# Altium project GameBoard_V1I1.PrjPcb (part 8 of 20)

## Sheet [19] - USB.SchDoc
size A2; DocumentNumber: 19; SheetNumber: 19; SheetTotal: 32
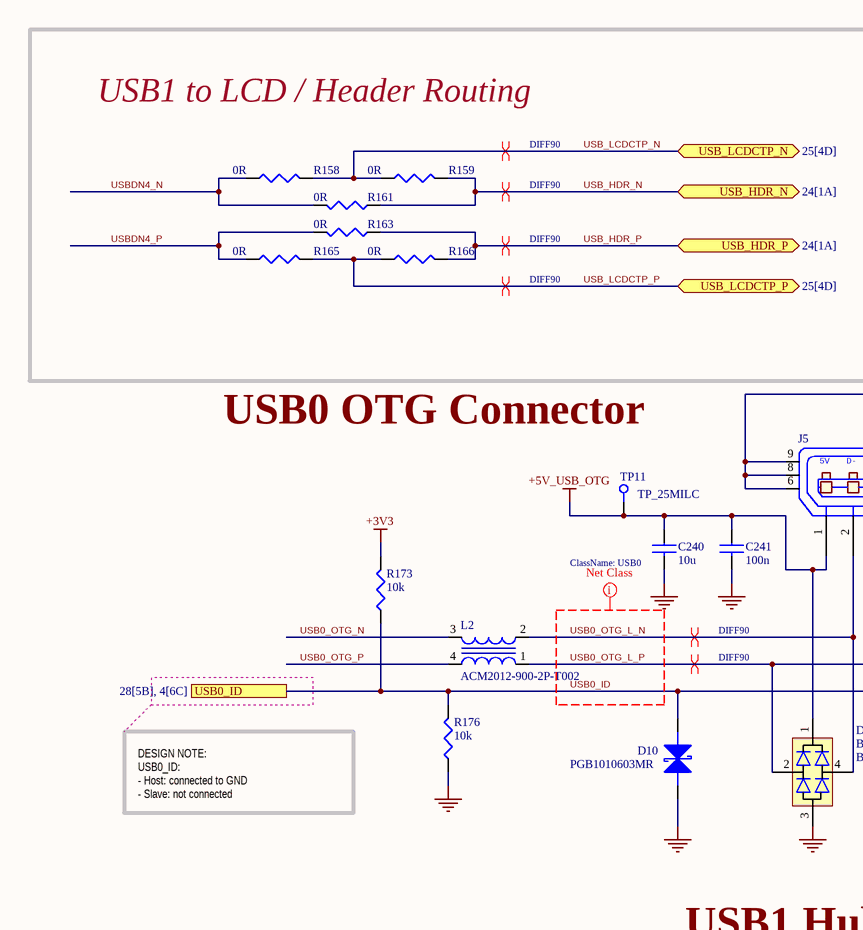
[diagram p48: [19] - USB.SchDoc, top left]
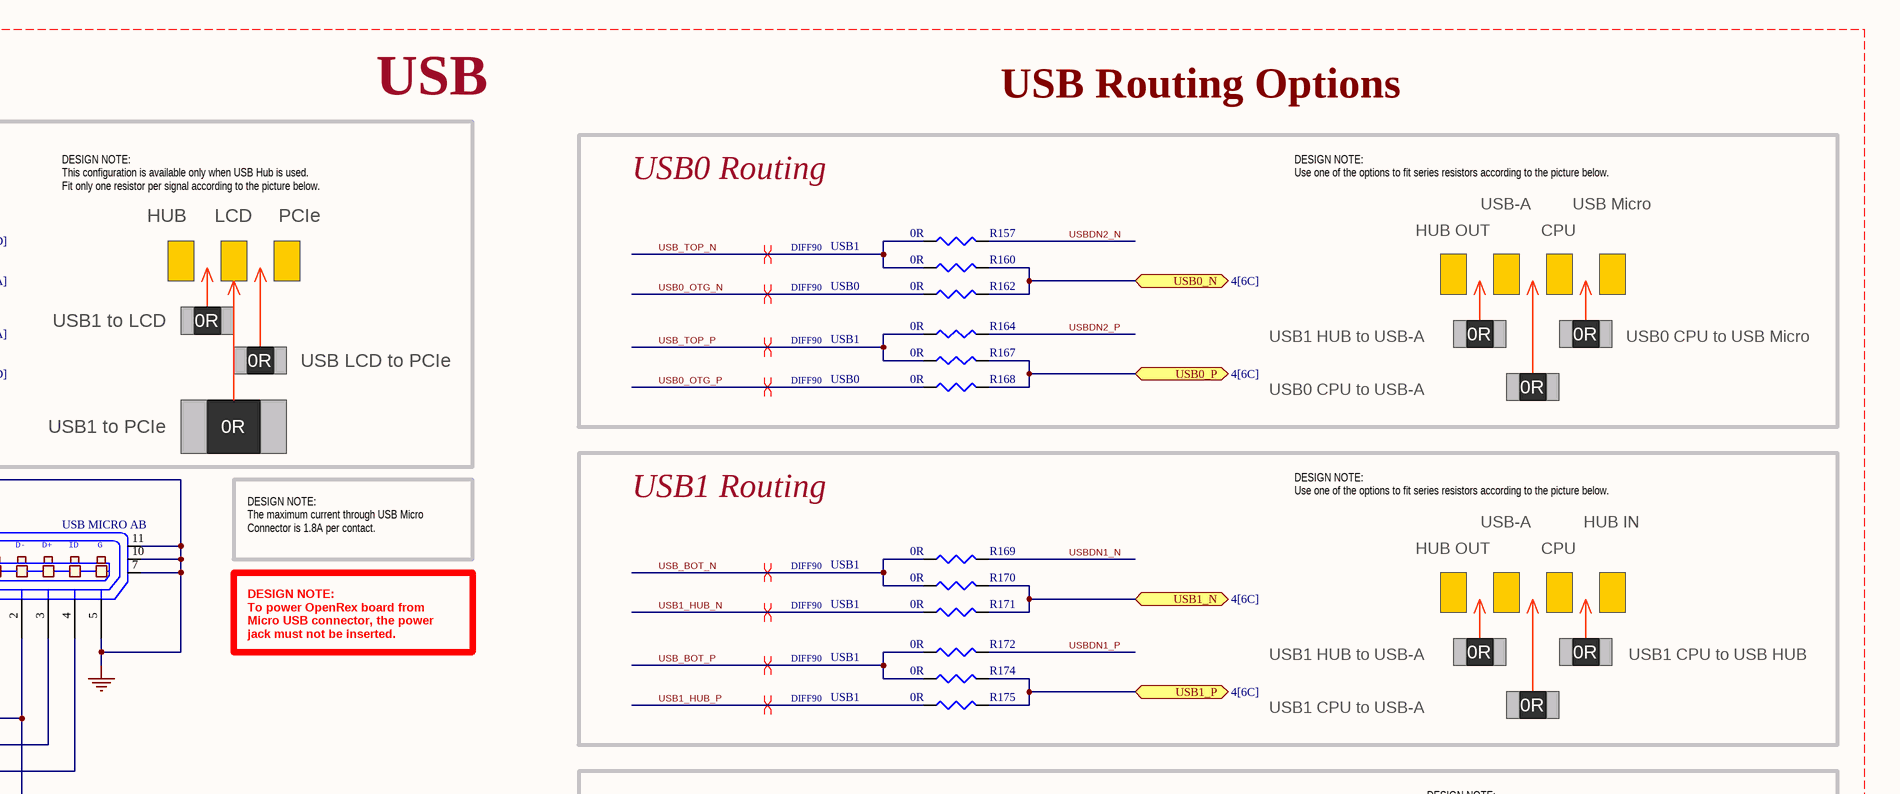
[diagram p49: [19] - USB.SchDoc, top right]
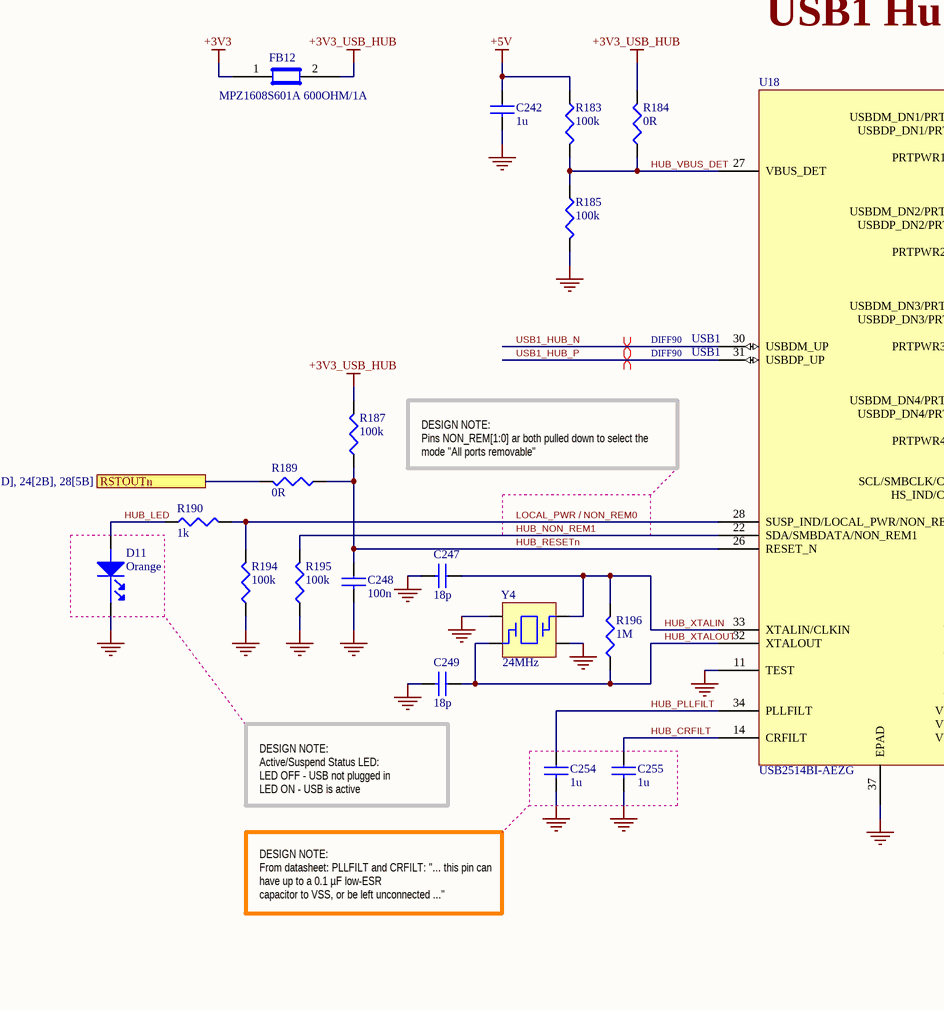
[diagram p50: [19] - USB.SchDoc, bottom left]
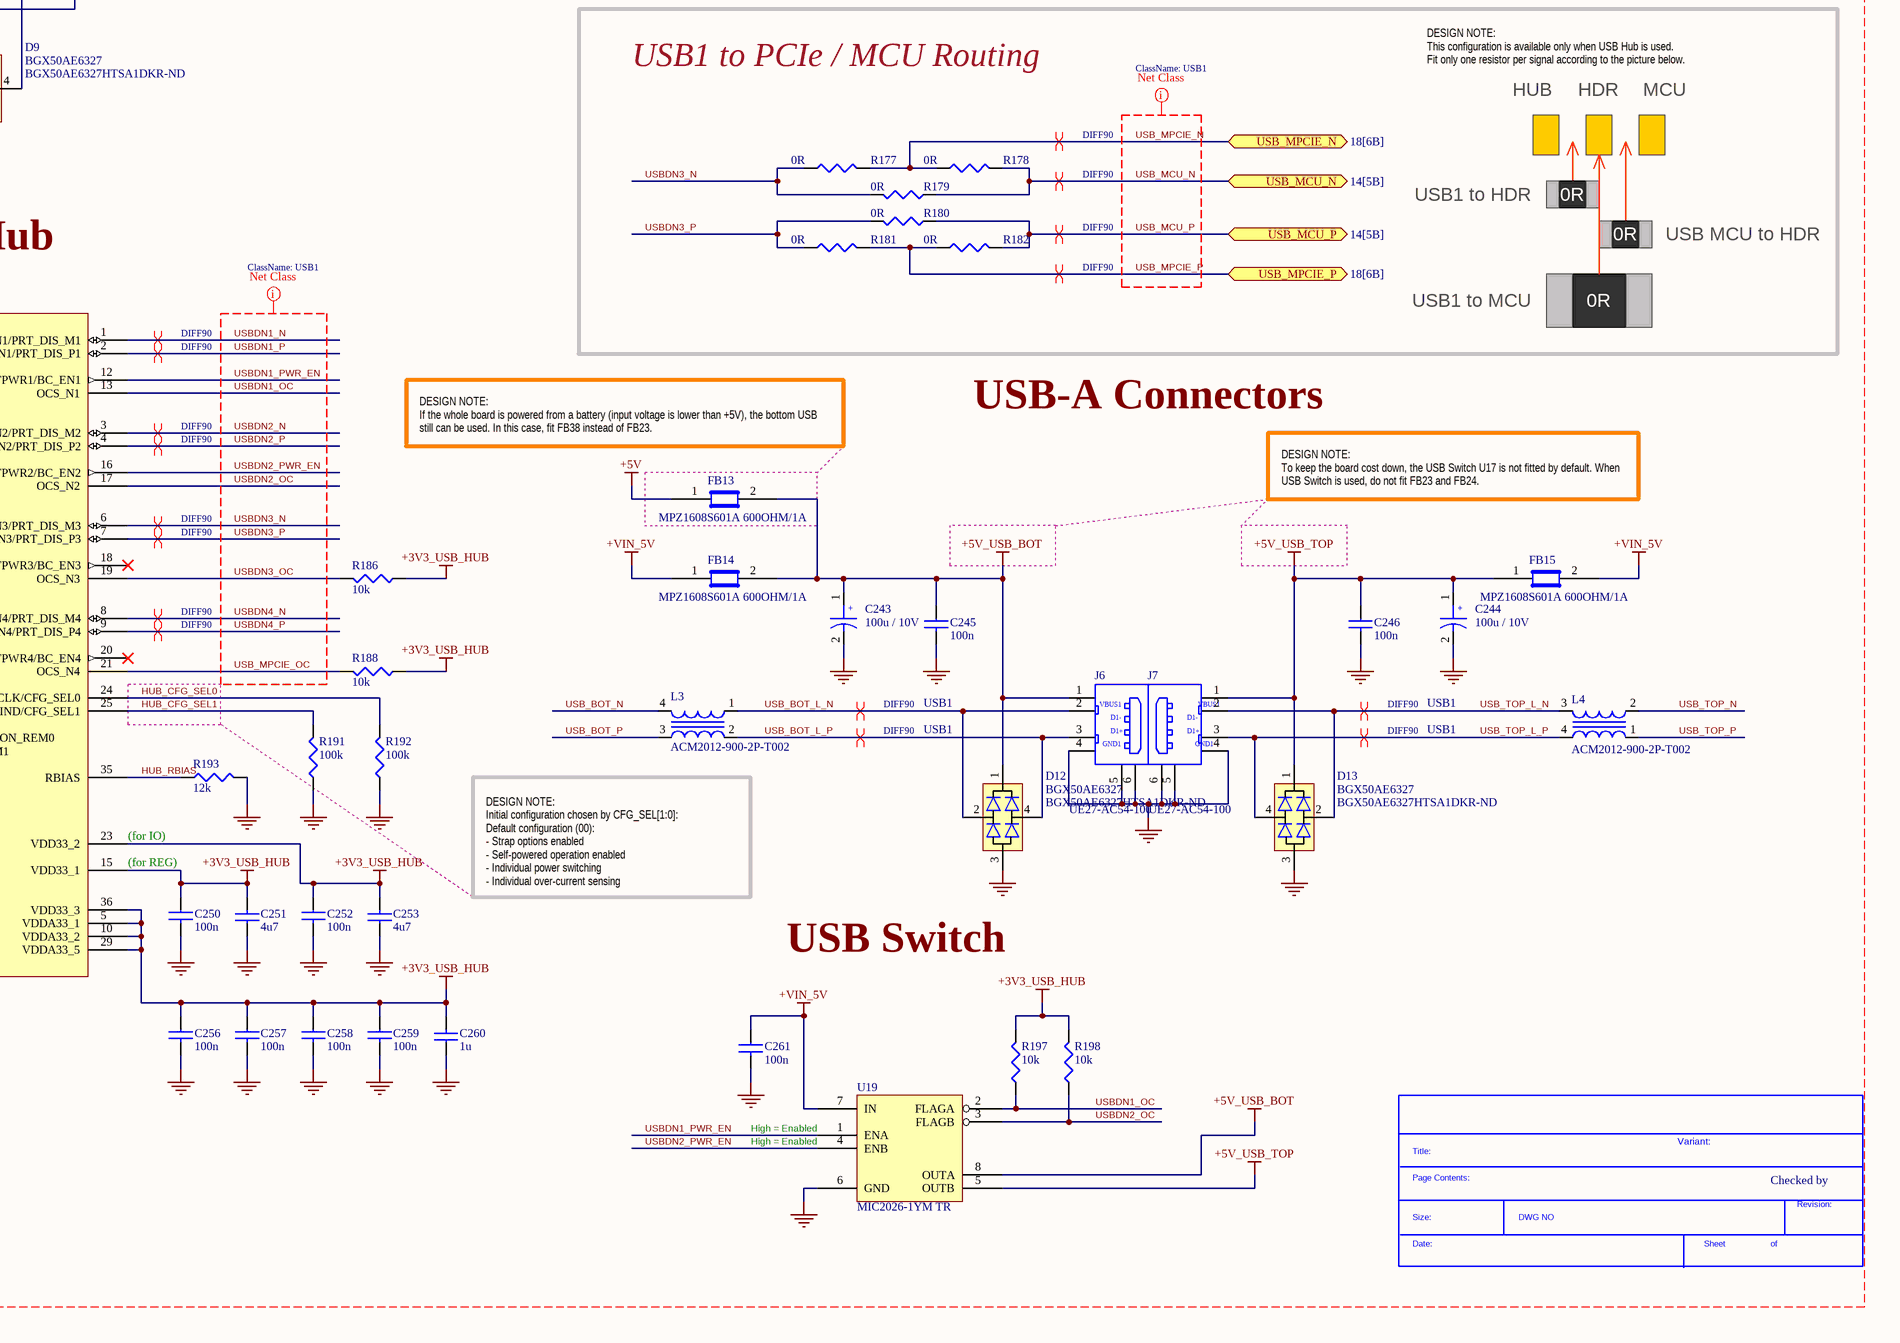
[diagram p51: [19] - USB.SchDoc, bottom right]

### Parts
(Parts that share a designator on the sheet are numbered #1, #2 ... from top to bottom, then left to right.)
*#16  SDTitleBlock  (value not drawn)  (graphical)
C240  10u  [C0603]
C241  100n  [C0402]
C242  1u  [C0402]
C243  100u / 10V  [C2312]
C244  100u / 10V  [C2312]
C245  100n  [C0402]
C246  100n  [C0402]
C247  18p  [C0402]
C248  100n  [C0402]
C249  18p  [C0402]
C250  100n  [C0402]
C251  4u7  [C0402]
C252  100n  [C0402]
C253  4u7  [C0402]
C254  1u  [C0402]
C255  1u  [C0402]
C256  100n  [C0402]
C257  100n  [C0402]
C258  100n  [C0402]
C259  100n  [C0402]
C260  1u  [C0402]
C261  100n  [C0402]
D9  BGX50AE6327  Supplier Part Number 1: BGX50AE6327HTSA1DKR-ND  [SOT143]
D10  PGB1010603MR  [C0603]
D11  Orange  [LED_0603]
D12  BGX50AE6327  Supplier Part Number 1: BGX50AE6327HTSA1DKR-ND  [SOT143]
D13  BGX50AE6327  Supplier Part Number 1: BGX50AE6327HTSA1DKR-ND  [SOT143]
FB12  MPZ1608S601A 600OHM/1A  [C0603]
FB13  MPZ1608S601A 600OHM/1A  [C0603]
FB14  MPZ1608S601A 600OHM/1A  [C0603]
FB15  MPZ1608S601A 600OHM/1A  [C0603]
J5  USB MICRO AB  [USB_Micro_AB]
J6  UE27-AC54-100  [USB-A]
J7  UE27-AC54-100  [USB-A]
L2  ACM2012-900-2P-T002  [ACM2012]
L3  ACM2012-900-2P-T002  [ACM2012]
L4  ACM2012-900-2P-T002  [ACM2012]
R157  0R  [R0402]
R158  0R  [R0402]
R159  0R  [R0402]
R160  0R  [R0402]
R161  0R  [R0805_small]
R162  0R  [R0402]
R163  0R  [R0805_small]
R164  0R  [R0402]
R165  0R  [R0402]
R166  0R  [R0402]
R167  0R  [R0402]
R168  0R  [R0402]
R169  0R  [R0402]
R170  0R  [R0402]
R171  0R  [R0402]
R172  0R  [R0402]
R173  10k  [R0402]
R174  0R  [R0402]
R175  0R  [R0402]
R176  10k  [R0402]
R177  0R  [R0402]
R178  0R  [R0402]
R179  0R  [R0805_small]
R180  0R  [R0805_small]
R181  0R  [R0402]
R182  0R  [R0402]
R183  100k  [R0402]
R184  0R  [R0402]
R185  100k  [R0402]
R186  10k  [R0402]
R187  100k  [R0402]
R188  10k  [R0402]
R189  0R  [R0402]
R190  1k  [R0402]
R191  100k  [R0402]
R192  100k  [R0402]
R193  12k  [R0402]
R194  100k  [R0402]
R195  100k  [R0402]
R196  1M  [R0402]
R197  10k  [R0402]
R198  10k  [R0402]
TP11  TP_25MILC  [TP_25C]  (no BOM)
U18  USB2514BI-AEZG  [QFN36_6mmx6mm]
U19  MIC2026-1YM TR  [8_SOIC_3.9MM]
Y4  24MHz  [ABM8]

### Blocks framed on the sheet
USB: R158 R159 R161 R163 R165 R166
USB0 Routing: R157 R160 R162 R164 R167 R168
USB1 Routing: R169-R172 R174 R175
USB1 to PCIe / MCU Routing: R177-R182

### Ports
RSTOUTn (see 11[6C], 14[4B], 23[1D], 24[2B], 28[5B]), USB0_ID (see 28[5B], 4[6C]), USB0_N (bidir, see 4[6C]), USB0_P (bidir, see 4[6C]), USB1_N (bidir, see 4[6C]), USB1_P (bidir, see 4[6C]), USB_HDR_N (bidir, see 24[1A]), USB_HDR_P (bidir, see 24[1A]), USB_LCDCTP_N (bidir, see 25[4D]), USB_LCDCTP_P (bidir, see 25[4D]), USB_MCU_N (bidir, see 14[5B]), USB_MCU_P (bidir, see 14[5B]), USB_MPCIE_N (bidir, see 18[6B]), USB_MPCIE_P (bidir, see 18[6B])

### Nets
+3V3: FB12.1 R173.2
+3V3_USB_HUB: C250.1 C251.2 C252.1 C253.2 C256.1 C257.1 C258.1 C259.1 C260.2 FB12.2 R184.2 R186.1 R187.2 R188.1 R197.2 R198.2 U18.5(VDDA33_1) U18.10(VDDA33_2) U18.15(VDD33_1) U18.23(VDD33_2) U18.29(VDDA33_5) U18.36(VDD33_3)
+5V: C242.1 FB13.1 R183.1
+5V_USB_BOT: C243.1 C245.1 D12.1 FB13.2 FB14.2 J6.1(VBUS) U19.8(OUTA)
+5V_USB_OTG: C240.1 C241.1 D9.1 J5.1(P1) TP11.1
+5V_USB_TOP: C244.1 C246.1 D13.1 FB15.1 J7.1(VBUS) U19.5(OUTB)
+VIN_5V: C261.1 FB14.1 FB15.2 U19.7(IN)
GND: C240.2 C241.2 C242.2 C243.2 C244.2 C245.2 C246.2 C247.2 C248.2 C249.2 C250.2 C251.1 C252.2 C253.1 C254.2 C255.2 C256.2 C257.2 C258.2 C259.2 C260.1 C261.2 D9.3 D10.2 D11.1(cathode) D12.3 D13.3 J5.5(P5) J5.6 J5.7 J5.8 J5.9 J5.10 J5.11 J6.4(GND) J6.5(SHIELD) J6.6(SHIELD) J7.4(GND) J7.5(SHIELD) J7.6(SHIELD) R176.1 R185.2 R191.1 R192.1 R193.2 R194.1 R195.1 U18.11(TEST) U18.37(EPAD) U19.6(GND) Y4.2 Y4.4
HUB_CFG_SEL0: R192.2 U18.24(SCL/SMBCLK/CFG_SEL0)
HUB_CFG_SEL1: R191.2 U18.25(HS_IND/CFG_SEL1)
HUB_CRFILT: C255.1 U18.14(CRFILT)
HUB_LED: D11.2(ANODE) R190.1
HUB_NON_REM1: R195.2 U18.22(SDA/SMBDATA/NON_REM1)
HUB_PLLFILT: C254.1 U18.34(PLLFILT)
HUB_RBIAS: R193.1 U18.35(RBIAS)
HUB_RESETn: C248.1 R187.1 R189.1 U18.26(RESET_N)
HUB_VBUS_DET: R183.2 R184.1 R185.1 U18.27(VBUS_DET)
HUB_XTALIN: C247.1 R196.2 U18.33(XTALIN/CLKIN) Y4.3
HUB_XTALOUT: C249.1 R196.1 U18.32(XTALOUT) Y4.1
LOCAL_PWR / NON_REM0: R190.2 R194.2 U18.28(SUSP_IND/LOCAL_PWR/NON_REM0)
RSTOUTn: R189.2 ; port RSTOUTn
USB0_ID: D10.1 J5.4(P4) R173.1 R176.2 ; port USB0_ID
USB0_N: R160.2 R162.2 ; port USB0_N
USB0_OTG_L_N: D9.4 J5.2(P2) L2.2
USB0_OTG_L_P: D9.2 J5.3(P3) L2.1
USB0_OTG_N: L2.3 R162.1
USB0_OTG_P: L2.4 R168.1
USB0_P: R167.2 R168.2 ; port USB0_P
USB1_HUB_N: R171.1 U18.30(USBDM_UP)
USB1_HUB_P: R175.1 U18.31(USBDP_UP)
USB1_N: R170.2 R171.2 ; port USB1_N
USB1_P: R174.2 R175.2 ; port USB1_P
USB_BOT_L_N: D12.2 J6.2(D-) L3.1
USB_BOT_L_P: D12.4 J6.3(D+) L3.2
USB_BOT_N: L3.4 R169.1 R170.1
USB_BOT_P: L3.3 R172.1 R174.1
USB_HDR_N: R159.2 R161.2 ; port USB_HDR_N
USB_HDR_P: R163.1 R166.2 ; port USB_HDR_P
USB_LCDCTP_N: R158.2 R159.1 ; port USB_LCDCTP_N
USB_LCDCTP_P: R165.2 R166.1 ; port USB_LCDCTP_P
USB_MCU_N: R178.2 R179.2 ; port USB_MCU_N
USB_MCU_P: R180.1 R182.2 ; port USB_MCU_P
USB_MPCIE_N: R177.2 R178.1 ; port USB_MPCIE_N
USB_MPCIE_OC: R188.2 U18.21(OCS_N4)
USB_MPCIE_P: R181.2 R182.1 ; port USB_MPCIE_P
USB_TOP_L_N: D13.2 J7.2(D-) L4.3
USB_TOP_L_P: D13.4 J7.3(D+) L4.4
USB_TOP_N: L4.2 R157.1 R160.1
USB_TOP_P: L4.1 R164.1 R167.1
USBDN1_N: R169.2 U18.1(USBDM_DN1/PRT_DIS_M1)
USBDN1_OC: R197.1 U18.13(OCS_N1) U19.2(FLAGA)
USBDN1_P: R172.2 U18.2(USBDP_DN1/PRT_DIS_P1)
USBDN1_PWR_EN: U18.12(PRTPWR1/BC_EN1) U19.1(ENA)
USBDN2_N: R157.2 U18.3(USBDM_DN2/PRT_DIS_M2)
USBDN2_OC: R198.1 U18.17(OCS_N2) U19.3(FLAGB)
USBDN2_P: R164.2 U18.4(USBDP_DN2/PRT_DIS_P2)
USBDN2_PWR_EN: U18.16(PRTPWR2/BC_EN2) U19.4(ENB)
USBDN3_N: R177.1 R179.1 U18.6(USBDM_DN3/PRT_DIS_M3)
USBDN3_OC: R186.2 U18.19(OCS_N3)
USBDN3_P: R180.2 R181.1 U18.7(USBDP_DN3/PRT_DIS_P3)
USBDN4_N: R158.1 R161.1 U18.8(USBDM_DN4/PRT_DIS_M4)
USBDN4_P: R163.2 R165.1 U18.9(USBDP_DN4/PRT_DIS_P4)

Not connected (* = marked no-connect by the designer): U18 18(PRTPWR3/BC_EN3)* 20(PRTPWR4/BC_EN4)*

### Layout directives
differential pair; net class DIFF90: USB0_OTG_L_N, USB0_OTG_L_P, USB_HDR_N, USB_HDR_P, USB_LCDCTP_N, USB_LCDCTP_P, USB_MCU_N, USB_MCU_P, USB_MPCIE_N, USB_MPCIE_P, USBDN1_N, USBDN1_P, USBDN2_N, USBDN2_P, USBDN3_N, USBDN3_P, USBDN4_N, USBDN4_P
net class USB1: USB_MCU_N, USB_MCU_P, USB_MPCIE_N, USB_MPCIE_OC, USB_MPCIE_P, USBDN1_N, USBDN1_OC, USBDN1_P, USBDN1_PWR_EN, USBDN2_N, USBDN2_OC, USBDN2_P, USBDN2_PWR_EN, USBDN3_N, USBDN3_OC, USBDN3_P, USBDN4_N, USBDN4_P
net class USB0: USB0_ID, USB0_OTG_L_N, USB0_OTG_L_P
differential pair; net class DIFF90; net class USB1: USB1_HUB_N, USB1_HUB_P, USB_BOT_L_N, USB_BOT_L_P, USB_BOT_N, USB_BOT_P, USB_TOP_L_N, USB_TOP_L_P, USB_TOP_N, USB_TOP_P
differential pair; net class DIFF90; net class USB0: USB0_OTG_N, USB0_OTG_P
net class [19] - USB: +3V3, +3V3_USB_HUB, +5V, +5V_USB_BOT, +5V_USB_OTG, +5V_USB_TOP, +VIN_5V, GND, HUB_CFG_SEL0, HUB_CFG_SEL1, HUB_CRFILT, HUB_LED, HUB_NON_REM1, HUB_PLLFILT, HUB_RBIAS, HUB_RESETn, HUB_VBUS_DET, HUB_XTALIN, HUB_XTALOUT, LOCAL_PWR / NON_REM0, USB0_ID, USB0_OTG_L_N, USB0_OTG_L_P, USB0_OTG_N, USB0_OTG_P, USB1_HUB_N, USB1_HUB_P, USB_BOT_L_N, USB_BOT_L_P, USB_BOT_N, USB_BOT_P, USB_HDR_N, USB_HDR_P, USB_LCDCTP_N, USB_LCDCTP_P, USB_MCU_N, USB_MCU_P, USB_MPCIE_N, USB_MPCIE_OC, USB_MPCIE_P, USB_TOP_L_N, USB_TOP_L_P, USB_TOP_N, USB_TOP_P, USBDN1_N, USBDN1_OC, USBDN1_P, USBDN1_PWR_EN, USBDN2_N, USBDN2_OC, USBDN2_P, USBDN2_PWR_EN, USBDN3_N, USBDN3_OC, USBDN3_P, USBDN4_N, USBDN4_P

### Notes on the sheet
- USB Routing Options
- USB1 to LCD / Header Routing
- DESIGN NOTE:
  This configuration is available only when USB Hub is used.
  Fit only one resistor per signal according to the picture below.
- HUB
- LCD
- PCIe
- DESIGN NOTE:
  Use one of the options to fit series resistors according to the picture below.
- HUB OUT
- USB-A
- CPU
- USB Micro
- USB1 to LCD
- 0R
- USB LCD to PCIe
- USB1 HUB to USB-A
- USB0 CPU to USB Micro
- USB1 to PCIe
- USB0 CPU to USB-A
- USB0 OTG Connector
- DESIGN NOTE:
  The maximum current through USB Micro Connector is 1.8A per contact.
- HUB IN
- DESIGN NOTE:
  To power OpenRex board from Micro USB connector, the power jack must not be inserted.
- USB1 CPU to USB HUB
- USB1 CPU to USB-A
- DESIGN NOTE:
  USB0_ID:
  - Host: connected to GND
  - Slave: not connected
- HDR
- MCU
- USB1 to HDR
- USB1 Hub
- USB MCU to HDR
- USB1 to MCU
- DESIGN NOTE:
  If the whole board is powered from a battery (input voltage is lower than +5V), the bottom USB still can be used. In this case, fit FB38 instead of FB23.
- USB-A Connectors
- DESIGN NOTE:
  To keep the board cost down, the USB Switch U17 is not fitted by default. When USB Switch is used, do not fit FB23 and FB24.
- DESIGN NOTE:
  Pins NON_REM[1:0] ar both pulled down to select the mode "All ports removable"
- (for IO)
- (for REG)
- DESIGN NOTE:
  Initial configuration chosen by CFG_SEL[1:0]:
  Default configuration (00):
  - Strap options enabled
  - Self-powered operation enabled
  - Individual power switching
  - Individual over-current sensing
- USB Switch
- DESIGN NOTE:
  Active/Suspend Status LED:
  LED OFF - USB not plugged in
  LED ON - USB is active
- DESIGN NOTE:
  From datasheet: PLLFILT and CRFILT: "... this pin can have up to a 0.1 µF low-ESR
  capacitor to VSS, or be left unconnected ..."
- (near U19) High = Enabled
- Variant:
- Checked by
- (in symbol 0475890001) 5V; D-; D+; ID; G
- (in symbol SDTitleBlock) Title:; Page Contents:; Revision:; Size:; DWG NO; Date:; Sheet; of
- (in symbol TPSC107K010R0150) +
- (in symbol UE27-AC54-100) VBUS1; D1-; D1+; GND1

### Library data of the parts
C240 = C1608X5R0J106M: CAP CER 10UF 6.3V X5R 20% 0603; Manufacturer: TDK Corporation; Capacitance: 10µF; Value: 10µF; .Checked PCB: used; Category: Capacitors; Supplier Part Number: 445-4112-1-ND; Manufacturer Part Number: C1608X5R0J106M; Operating Temperature: -55°C ~ 85°C; Package / Case: 0603 (1608 Metric); Price 1k [$]: 0.08580; .Checked SCH: used; Voltage - Rated: 6.3V; Features: Low ESR; Supplier: Digikey; Supplier 1: Digi-Key; Supplier Part Number 1: 445-4112-1-ND; RoHS: RoHS Compliant; Stock 1: 48157; Pricing 1: 1=0.46, 10=0.363, 100=0.1898, 250=0.14024, 500=0.1089, 1000=0.0858 (USD); Tolerance: ±20%; Temperature Coefficient: X5R; Mounting Type: Surface Mount, MLCC; Applications: General Purpose; Ratings: -; Size / Dimension: 0.063" L x 0.031" W (1.60mm x 0.80mm); Height - Seated (Max): -; Thickness (Max): 0.037" (0.95mm); Lead Spacing: -; Packaging: Cut Tape (CT); Lead Style: -; ComponentLink1URL: http://www.tdk.com/pdf/general_B11.pdf; ComponentLink1Description: http://www.tdk.com/pdf/general_B11.pdf
C241 C245 C246 C248 C250 C252 C256-C259 C261 = C1005X5R1H104K: CAP CER .10UF 50V X5R 10% 0402; Manufacturer: TDK Corporation; Capacitance: 0.1µF; Value: 100nF; .Checked PCB: used; Category: Capacitors; Supplier Part Number: 445-5942-1-ND; Manufacturer Part Number: C1005X5R1H104K; Operating Temperature: -55°C ~ 85°C; Package / Case: 0402 (1005 Metric); Price 1k [$]: 0.02340; .Checked SCH: used; Voltage - Rated: 50V; Supplier: Digikey; Supplier 1: Digi-Key; Supplier Part Number 1: 445-5942-1-ND; RoHS: RoHS Compliant; Stock 1: 106926; Pricing 1: 1=0.27, 10=0.18, 100=0.072, 250=0.05176, 500=0.0369, 1000=0.027 (USD); Tolerance: ±10%; Temperature Coefficient: X5R; Mounting Type: Surface Mount, MLCC; Applications: General Purpose; Ratings: -; Size / Dimension: 0.039" L x 0.020" W (1.00mm x 0.50mm); Height - Seated (Max): -; Thickness (Max): 0.022" (0.55mm); Lead Spacing: -; Features: -; Packaging: Cut Tape (CT); Lead Style: -; ComponentLink1URL: http://www.tdk.co.jp/tefe02/e412_c.pdf; ComponentLink1Description: http://www.tdk.co.jp/tefe02/e412_c.pdf; Supplier 2: Digi-Key; Supplier Part Number 2: 311-1697-6-ND
C242 C254 C255 C260 = C1005X5R1C105K: CAP CER 1.0UF 16V X5R 0402; Manufacturer: TDK Corporation; Capacitance: 1.0µF; Value: 1uF; .Checked PCB: used; Tolerance: ±10%; Category: Capacitors; Supplier Part Number: 445-4978-1-ND; Manufacturer Part Number: C1005X5R1C105K; Operating Temperature: -55°C ~ 85°C; Package / Case: 0402 (1005 Metric); Price 1k [$]: 0.02080; .Checked SCH: used; Voltage - Rated: 16V; Supplier: Digikey; Supplier 1: Digi-Key; Supplier Part Number 1: 445-4978-1-ND; RoHS: RoHS Compliant; Stock 1: 341010; Pricing 1: 1=0.24, 10=0.16, 100=0.064, 250=0.046, 500=0.0328, 1000=0.024 (USD); Temperature Coefficient: X5R; Mounting Type: Surface Mount, MLCC; Applications: General Purpose; Ratings: -; Size / Dimension: 0.039" L x 0.020" W (1.00mm x 0.50mm); Height - Seated (Max): -; Thickness (Max): 0.022" (0.55mm); Lead Spacing: -; Features: -; Packaging: Cut Tape (CT); Lead Style: -; ComponentLink1URL: http://www.tdk.co.jp/tefe02/e412_c.pdf; ComponentLink1Description: http://www.tdk.co.jp/tefe02/e412_c.pdf; Supplier 2: Digi-Key; Supplier Part Number 2: 445-13181-1-ND
C243 C244 = TPSC107K010R0150: CAP TANT 100UF 10V 10% 2312; Manufacturer: AVX Corporation; Manufacturer Size Code: C; Capacitance: 100µF; ESR (Equivalent Series Resistance): 150 mOhm; Type: Molded; .Creator: MM; .Checked PCB: used; Supplier 1: Digi-Key; Manufacturer Part Number: TPSC107K010R0150; RoHS: RoHS Compliant; Category: Capacitors; Stock 1: 3211; Pricing 1: 1=1, 10=0.85, 100=0.4969, 250=0.4168 (USD); Packaging: Cut Tape (CT); Tolerance: ±10%; Voltage - Rated: 10V; Operating Temperature: -55°C ~ 125°C; Mounting Type: Surface Mount; Package / Case: 2312 (6032 Metric); Size / Dimension: 0.236" L x 0.126" W (6.00mm x 3.20mm); Height - Seated (Max): 0.110" (2.80mm); Lead Spacing: -; Features: General Purpose; Lifetime @ Temp.: -; ComponentLink1URL: http://www.avx.com/docs/Catalogs/tps.pdf; ComponentLink1Description: http://www.avx.com/docs/Catalogs/tps.pdf; Supplier Part Number 1: 478-7995-1-ND; .Checked SCH: used
C247 C249 = C1005C0G1H180J: CAP CER 18PF 50V C0G 5% 0402; Manufacturer: TDK Corporation; .Checked PCB: used; Temperature Coefficient: C0G, NP0; Capacitance: 18pF; Category: Capacitors; Supplier Part Number: 445-1238-1-ND; Manufacturer Part Number: C1005C0G1H180J; Operating Temperature: -55°C ~ 125°C; Package / Case: 0402 (1005 Metric); Price 1k [$]: 0.00468; Value: 18pF; .Checked SCH: used; Voltage - Rated: 50V; Supplier: Digikey; Supplier 1: Digi-Key; Supplier Part Number 1: 445-1238-1-ND; RoHS: RoHS Compliant; Stock 1: 24321; Pricing 1: 1=0.08, 10=0.05, 100=0.018, 250=0.013, 500=0.0096, 1000=0.0065 (USD); Tolerance: ±5%; Mounting Type: Surface Mount, MLCC; Applications: General Purpose; Ratings: -; Size / Dimension: 0.039" L x 0.020" W (1.00mm x 0.50mm); Height - Seated (Max): -; Thickness (Max): 0.022" (0.55mm); Lead Spacing: -; Features: -; Packaging: Cut Tape (CT); Lead Style: -; ComponentLink1URL: http://www.tdk.co.jp/tefe02/e412_c.pdf; ComponentLink1Description: http://www.tdk.co.jp/tefe02/e412_c.pdf
C251 C253 = C1005X5R1A475M: CAP CER 4.7UF 10V 20% X5R 0402; Manufacturer: TDK Corporation; Capacitance: 4.7µF; .Checked PCB: used; Supplier 1: Digi-Key; Supplier Part Number 1: 445-8023-1-ND; Manufacturer Part Number: C1005X5R1A475M; RoHS: RoHS Compliant; Category: Capacitors; Stock 1: 10140; Pricing 1: 1=0.53, 10=0.415, 100=0.25, 250=0.18752, 500=0.16, 1000=0.125, 5000=0.095 (USD); Voltage - Rated: 10V; Tolerance: ±20%; Temperature Coefficient: X5R; Mounting Type: Surface Mount, MLCC; Operating Temperature: -55°C ~ 85°C; Applications: General Purpose; Ratings: -; Package / Case: 0402 (1005 Metric); Size / Dimension: 0.039" L x 0.020" W (1.00mm x 0.50mm); Height - Seated (Max): -; Thickness (Max): -; Lead Spacing: -; Features: -; Packaging: Cut Tape (CT); Lead Style: -; ComponentLink1URL: http://www.tdk.com/pdf/general_B11.pdf; ComponentLink1Description: http://www.tdk.com/pdf/general_B11.pdf; .Checked SCH: used
D9 D12 D13 = BGX50AE6327: DIODE SWITCHING 50V SOT-143; Manufacturer: Infineon Technologies; .Checked PCB: used; Current - DC Forward (If): 140mA; Diode Type: Single Phase; Speed: Small Signal =< 200mA (Io), Any Speed; Reverse Recovery Time (trr): 6ns; Max Repetitive Reverse Voltage (Vrrm): 70V; Forward Voltage: 1.3V; Peak Reverse Current: 100uA; Max Power Dissipation: 210mW; .Checked SCH: used; Category: Discrete Semiconductor Products; Family: Bridge Rectifiers; Manufacturer Part Number: BGX50AE6327; Package / Case: TO-253-4, TO-253AA; Price 1k [$]: 0.10013; Supplier: Digikey; Supplier Part Number: BGX50AINCT-ND; Value: BGX50AE6327; Supplier 1: Digi-Key; RoHS: RoHS Compliant; Stock 1: 0; Pricing 1: 1=0.39, 10=0.294, 100=0.1829, 500=0.12514, 1000=0.09626 (USD); Voltage - Peak Reverse (Max): 50V; Mounting Type: Surface Mount; Packaging: Cut Tape (CT); Supplier Device Package: PG-SOT143-4; ComponentLink1URL: http://www.infineon.com/dgdl/bgx50aseries.pdf?folderId=db3a30431400ef6801141cc1c4cd04e8&fileId=db3a30431400ef6801141cc423c404e9; ComponentLink1Description: http://www.infineon.com/dgdl/bgx50aseries.pdf?folderId=db3a30431400ef6801141cc1c4cd04e8&fileId=db3a30431400ef6801141cc423c404e9; Mount: Surface Mount; Case/Package: SOT-143-4; Number of Pins: 4; Contact Plating: Matte,Tin; Min Operating Temperature: -65°C; Max Operating Temperature: 150°C; Forward Current: 140mA; Reverse Recovery Time: 6ns; Recovery Time: 6ns; Package Quantity: 3000; Length: 2.9mm; Height: 1mm; Width: 1.3mm
D10 = PGB1010603MR: SUPPRESSOR ESD 24VDC 0603 SMD; Manufacturer: Littelfuse Inc; Voltage - Reverse Standoff (Typ): 24V; Polarization: Bidirectional; .Creator: MM; .Checked PCB: used; Supplier 1: Digi-Key; Manufacturer Part Number: PGB1010603MR; RoHS: RoHS Compliant; Category: Circuit Protection; Stock 1: 155406; Pricing 1: 1=0.66, 10=0.556, 25=0.4872, 100=0.4172, 250=0.3618, 500=0.30646 (USD); Packaging: Cut Tape (CT); Voltage - Breakdown: -; Power (Watts): -; Mounting Type: Surface Mount; Package / Case: 0603 (1608 Metric); Supplier Device Package: 0603 (1608 Metric); ComponentLink1URL: http://www.littelfuse.com/data/en/Data_Sheets/Littelfuse_PulseGuard-ESD_PGB1.pdf; ComponentLink1Description: http://www.littelfuse.com/data/en/Data_Sheets/Littelfuse_PulseGuard-ESD_PGB1.pdf; Supplier Part Number 1: F2594CT-ND; .Checked SCH: used
D11 = LO L29K-H2K1-24-Z: LED SMARTLED ORANGE 606NM 0603; Manufacturer: OSRAM Opto Semiconductors Inc; Millicandela Rating: 6.3mcd; Voltage - Forward (Vf) Typ: 1.8V; Current - Test: 2mA; Wavelength - Peak: 610nm; Viewing Angle: 160°; Lens Type: Diffused; Lens Style/Size: Rectangle with Flat Top, 1.3mm x 0.8mm; Luminous Flux @ Current - Test: 25 mlm; .Checked PCB: used; Supplier 1: Digi-Key; Supplier Part Number 1: 475-2740-1-ND; Manufacturer Part Number: LO L29K-H2K1-24-Z; RoHS: RoHS Compliant; Category: Optoelectronics; Stock 1: 15900; Pricing 1: 1=0.17, 10=0.141, 100=0.1127, 250=0.0986, 500=0.09016 (USD); Color: Orange; Wavelength - Dominant: 606nm; Package / Case: 0603 (1608 Metric); Size / Dimension: 1.70mm L x 0.80mm W; Height: 0.65mm; Mounting Type: Surface Mount; Packaging: Cut Tape (CT); ComponentLink1URL: http://catalog.osram-os.com/catalogue/catalogue.do;jsessionid=302CF83AF637AE24E40AEB0ADA267EDD?act=downloadFile&favOid=020000010003f9de000100b6; ComponentLink1Description: http://catalog.osram-os.com/catalogue/catalogue.do;jsessionid=302CF83AF637AE24E40AEB0ADA267EDD?act=downloadFile&favOid=020000010003f9de000100b6; .Checked SCH: used
FB12-FB15 = MPZ1608S601A: FERRITE CHIP BEAD 600 OHM SMD 1A; Manufacturer: TDK Corporation; Impedance @ Frequency: 600 Ohm @ 100MHz; DC Resistance (DCR): 150 mOhm Max; Filter Type: Differential Mode - Single; Number of Lines: 1; .Checked PCB: used; Supplier 1: Digi-Key; Supplier Part Number 1: 445-2205-1-ND; Manufacturer Part Number: MPZ1608S601A; RoHS: RoHS Compliant; Category: Filters; Stock 1: 328345; Pricing 1: 1=0.36, 10=0.24, 100=0.096, 250=0.069, 500=0.0492, 1000=0.036 (USD); Current Rating: 1A; Package / Case: 0603 (1608 Metric); Mounting Type: Surface Mount; Packaging: Cut Tape (CT); Height (Max): 0.037" (0.95mm); Size / Dimension: 0.063" L x 0.031" W (1.60mm x 0.80mm); ComponentLink1URL: http://www.tdk.co.jp/tefe02/e9413_mpz.pdf; ComponentLink1Description: http://www.tdk.co.jp/tefe02/e9413_mpz.pdf; .Checked SCH: used
J5 = 0475890001: CONN RCPT MICRO USB AB R/A SMD; Manufacturer: Molex Inc; Connector Type: USB - micro AB; Number of Contacts: 5; Gender: Receptacle; .Creator: MM; .Checked PCB: used; Supplier 1: Digi-Key; Manufacturer Part Number: 0475890001; RoHS: RoHS Compliant; Category: Connectors, Interconnects; Stock 1: 12754; Pricing 1: 1=0.81, 10=0.764, 25=0.6872, 50=0.6108, 100=0.5854, 250=0.53452, 500=0.50908 (USD); Packaging: Cut Tape (CT); Specifications: -; Mounting Type: Surface Mount, Right Angle, Horizontal; Features: Board Guide, Shielded; Ingress Protection: -; ComponentLink1URL: http://www.molex.com/pdm_docs/sd/475890001_sd.pdf; ComponentLink1Description: http://www.molex.com/pdm_docs/sd/475890001_sd.pdf; Supplier Part Number 1: WM17143CT-ND; .Checked SCH: used
J6 J7 = UE27-AC54-100: USB - A USB 2.0 Receptacle Connector 4 Position Through Hole, Right Angle, Horizontal; Manufacturer: Amphenol Commercial; Number of Contacts: 4; Number of Ports: 1; Max Voltage Rating (AC): 30V; .Creator: MB; Supplier 1: Digi-Key; Manufacturer Part Number: UE27-AC54-100; Stock 1: 16102; Pricing 1: 1=0.52, 10=0.486, 25=0.4376, 50=0.3888, 100=0.3726, 250=0.3402, 500=0.324, 1000=0.2673, 2500=0.243 (USD); Mount: Through Hole,Horizontal; Case/Package: Module; Contact Plating: Nickel,Tin,Gold; Contact Material: Nickel,Copper Alloy; Colour: Black; Number of Terminals: 4; Housing Material: Thermoplastic; Min Operating Temperature: -55°C; Max Operating Temperature: 85°C; Termination: Solder; Orientation: Right Angle; Package Quantity: 120; Packaging: Tray; Gender: Receptacle; Connector Type: USB; Number of Positions: 4; Length: 14.5mm; Depth: 13.85mm; Radiation Hardening: No; REACH SVHC: Unknown; Lead Free: Lead Free; Flammability Rating: UL94 V-0; ComponentLink1URL: https://datasheet.ciiva.com/3095/usb-cat-3095736.pdf; ComponentLink1Description: https://datasheet.ciiva.com/3095/usb-cat-3095736.pdf; ComponentLink2URL: https://datasheet.ciiva.com/16668/usb-cat-16668272.pdf; ComponentLink2Description: https://datasheet.ciiva.com/16668/usb-cat-16668272.pdf; ComponentLink3URL: https://datasheet.ciiva.com/851/ue27acx4x0x-851297.pdf; ComponentLink3Description: https://datasheet.ciiva.com/851/ue27acx4x0x-851297.pdf; ComponentLink4URL: https://datasheet.ciiva.com/12494/ue27acx4x0x-45641-12494043.pdf; ComponentLink4Description: https://datasheet.ciiva.com/12494/ue27acx4x0x-45641-12494043.pdf; Supplier Part Number 1: UE27AC54100-ND; .Checked SCH: *; .Checked PCB: *
L2-L4 = ACM2012-900-2P-T002: CHOKE COMM MODE 90 OHM .4A SMD; Manufacturer: TDK Corporation; Filter Type: Data, Signal Line; Number of Lines: 2; Current: 400mA; DC Resistance (DCR): 190 mOhm Max; Impedance: 90 Ohm; Resistance (Ohms): 8.2K; Power (Watts): 0.063W, 1/16W; Temperature Coefficient: ±100ppm/°C; Tolerance: ±1%; .Checked PCB: used; Supplier 1: Digi-Key; Supplier Part Number 1: 445-2207-1-ND; Manufacturer Part Number: ACM2012-900-2P-T002; RoHS: RoHS Compliant; Category: Filters; Stock 1: 175768; Pricing 1: 1=0.48, 10=0.448, 50=0.42, 100=0.364, 500=0.308, 1000=0.252 (USD); Inductance: -; Mounting Type: Surface Mount; Size / Dimension: 0.079" L x 0.047" W (2.00mm x 1.20mm); Height (Max): 0.051" (1.30mm); Package / Case: 0805 (2012 Metric), 4 Lead; Operating Temperature: -25°C ~ 85°C; Packaging: Cut Tape (CT); ComponentLink1URL: http://www.tdk.co.jp/tefe02/e9719_acm2012.pdf; ComponentLink1Description: http://www.tdk.co.jp/tefe02/e9719_acm2012.pdf; Composition: Thick Film; Features: -; Height: 0.016" (0.40mm); Number of Terminations: 2; ComponentLink2URL: http://www.yageo.com/documents/recent/PYu-RC0402_51_RoHS_L_6.pdf; ComponentLink2Description: http://www.yageo.com/documents/recent/PYu-RC0402_51_RoHS_L_6.pdf; .Checked SCH: used; Supplier 2: Digi-Key; Supplier Part Number 2: SRF2012-900YACT-ND
R157-R160 R162 R164-R172 R174 R175 R177 R178 R181 R182 R184 R189 = RC0402JR-070RL: RES 0.0 OHM 1/16W 0402 SMD; Manufacturer: Yageo; Resistance (Ohms): 0.0; Power (Watts): 0.063W, 1/16W; Tolerance: Jumper; .Checked PCB: used; Category: Resistors; Supplier Part Number: 311-0.0JRCT-ND; Manufacturer Part Number: RC0402JR-070RL; Package / Case: 0402 (1005 Metric); Price 1k [$]: 0.01389; Value: 0R; .Checked SCH: used; Supplier: Digikey; Supplier 1: Digi-Key; Supplier Part Number 1: 311-0.0JRCT-ND; RoHS: RoHS Compliant; Stock 1: 1106330; Pricing 1: 10=0.012, 50=0.009, 100=0.0069, 250=0.00512, 500=0.0038, 1000=0.00253 (USD); Composition: Thick Film; Features: -; Temperature Coefficient: -; Size / Dimension: 0.039" L x 0.020" W (1.00mm x 0.50mm); Height: 0.016" (0.40mm); Number of Terminations: 2; Packaging: Cut Tape (CT); ComponentLink1URL: http://www.yageo.com/documents/recent/PYu-RC0402_51_RoHS_L_6.pdf; ComponentLink1Description: http://www.yageo.com/documents/recent/PYu-RC0402_51_RoHS_L_6.pdf
R161 R163 R179 R180 = RC0805JR-070RL_small: RES 0.0 OHM 1/8W 0805 SMD; Manufacturer: Yageo; Resistance (Ohms): 0.0; Power (Watts): 0.125W, 1/8W; Tolerance: Jumper; .Checked PCB: used; .Creator: MM; Category: Resistors; Supplier Part Number: 311-0.0ARCT-ND; Manufacturer Part Number: RC0805JR-070RL; Package / Case: 0805 (2012 Metric); Price 1k [$]: 0.01479; Value: 0R; .Checked SCH: used; Supplier: Digikey; Supplier 1: Digi-Key; Supplier Part Number 1: 311-0.0ARCT-ND; RoHS: RoHS Compliant; Stock 1: 933202; Pricing 1: 10=0.017, 50=0.0126, 100=0.0096, 250=0.00716, 500=0.00528, 1000=0.00352 (USD); Composition: Thick Film; Features: -; Temperature Coefficient: -; Size / Dimension: 0.079" L x 0.049" W (2.00mm x 1.25mm); Height: 0.024" (0.60mm); Number of Terminations: 2; Packaging: Cut Tape (CT); ComponentLink1URL: http://www.yageo.com/documents/recent/PYu-RC0805_51_RoHS_L_4.pdf; ComponentLink1Description: http://www.yageo.com/documents/recent/PYu-RC0805_51_RoHS_L_4.pdf
R173 R176 R186 R188 R197 R198 = RC0402FR-0710KL: RES 10.0K OHM 1/16W 1% 0402 SMD; Manufacturer: Yageo; Power (Watts): 0.063W, 1/16W; .Checked PCB: used; Temperature Coefficient: ±100ppm/°C; Category: Resistors; Supplier Part Number: 311-10.0KLRCT-ND; Manufacturer Part Number: RC0402FR-0710KL; Package / Case: 0402 (1005 Metric); Price 1k [$]: 0.01421; Resistance (Ohms): 10K; Tolerance: ±1%; Value: 10k; .Checked SCH: used; Supplier: Digikey; Supplier 1: Digi-Key; Supplier Part Number 1: 311-10.0KLRCT-ND; RoHS: RoHS Compliant; Stock 1: 2916495; Pricing 1: 10=0.014, 50=0.0104, 100=0.0079, 250=0.00584, 500=0.00432, 1000=0.00288 (USD); Composition: Thick Film; Features: -; Size / Dimension: 0.039" L x 0.020" W (1.00mm x 0.50mm); Height: 0.016" (0.40mm); Number of Terminations: 2; Packaging: Cut Tape (CT); ComponentLink1URL: http://www.yageo.com/documents/recent/PYu-RC0402_51_RoHS_L_6.pdf; ComponentLink1Description: http://www.yageo.com/documents/recent/PYu-RC0402_51_RoHS_L_6.pdf
R183 R185 R187 R191 R192 R194 R195 = RMCF0402FT100K: RES 100K OHM 1/16W 1% 0402 SMD; Manufacturer: Stackpole Electronics Inc; Power (Watts): 0.063W, 1/16W; .Checked PCB: used; Temperature Coefficient: ±100ppm/°C; Category: Resistors; Supplier Part Number: RMCF0402FT100KCT-ND; Manufacturer Part Number: RMCF0402FT100K; Package / Case: 0402 (1005 Metric); Price 1k [$]: 0.00384; Resistance (Ohms): 100K; Tolerance: ±1%; Value: 100k; .Checked SCH: used; Supplier: Digikey; Supplier 1: Digi-Key; Supplier Part Number 1: YAG1343DKR-ND; RoHS: RoHS Compliant; Composition: Thick Film; Features: -; Size / Dimension: 0.039" L x 0.020" W (1.00mm x 0.50mm); Height: 0.016" (0.40mm); Number of Terminations: 2; Packaging: Cut Tape (CT); ComponentLink1URL: http://www.seielect.com/Catalog/SEI-RMCF.pdf; ComponentLink1Description: http://www.seielect.com/Catalog/SEI-RMCF.pdf
R190 = RC0402FR-071KL: RES 1.00K OHM 1/16W 1% 0402 SMD; Manufacturer: Yageo; Power (Watts): 0.063W, 1/16W; .Checked PCB: used; Temperature Coefficient: ±100ppm/°C; Category: Resistors; Supplier Part Number: 311-1.00KLRCT-ND; Manufacturer Part Number: RC0402FR-071KL; Package / Case: 0402 (1005 Metric); Price 1k [$]: 0.01421; Resistance (Ohms): 1K; Tolerance: ±1%; Value: 1k; .Checked SCH: used; Supplier: Digikey; Supplier 1: Digi-Key; Supplier Part Number 1: 311-1.00KLRCT-ND; RoHS: RoHS Compliant; Stock 1: 1753477; Pricing 1: 10=0.014, 50=0.0104, 100=0.0079, 250=0.00584, 500=0.00432, 1000=0.00288 (USD); Composition: Thick Film; Features: -; Size / Dimension: 0.039" L x 0.020" W (1.00mm x 0.50mm); Height: 0.016" (0.40mm); Number of Terminations: 2; Packaging: Cut Tape (CT); ComponentLink1URL: http://www.yageo.com/documents/recent/PYu-RC0402_51_RoHS_L_6.pdf; ComponentLink1Description: http://www.yageo.com/documents/recent/PYu-RC0402_51_RoHS_L_6.pdf
R193 = RC0402FR-0712KL: RES 12.0K OHM 1/16W 1% 0402 SMD; Manufacturer: Yageo; Power (Watts): 0.063W, 1/16W; .Checked PCB: used; Temperature Coefficient: ±100ppm/°C; Category: Resistors; Supplier Part Number: 311-12.0KLRCT-ND; Manufacturer Part Number: RC0402FR-0712KL; Package / Case: 0402 (1005 Metric); Price 1k [$]: 0.01421; Resistance (Ohms): 12K; Tolerance: ±1%; Value: 12k; .Checked SCH: used; Supplier: Digikey; Supplier 1: Digi-Key; Supplier Part Number 1: 311-12.0KLRCT-ND; RoHS: RoHS Compliant; Stock 1: 526086; Pricing 1: 10=0.014, 50=0.0104, 100=0.0079, 250=0.00584, 500=0.00432, 1000=0.00288 (USD); Composition: Thick Film; Features: -; Size / Dimension: 0.039" L x 0.020" W (1.00mm x 0.50mm); Height: 0.016" (0.40mm); Number of Terminations: 2; Packaging: Cut Tape (CT); ComponentLink1URL: http://www.yageo.com/documents/recent/PYu-RC0402_51_RoHS_L_6.pdf; ComponentLink1Description: http://www.yageo.com/documents/recent/PYu-RC0402_51_RoHS_L_6.pdf
R196 = RC0402FR-071ML: RES 1.00M OHM 1/16W 1% 0402 SMD; Manufacturer: Yageo; Power (Watts): 0.063W, 1/16W; .Checked PCB: used; Temperature Coefficient: ±100ppm/°C; Category: Resistors; Supplier Part Number: 311-1.00MLRCT-ND; Manufacturer Part Number: RC0402FR-071ML; Package / Case: 0402 (1005 Metric); Price 1k [$]: 0.00288; Resistance (Ohms): 1M; Tolerance: ±1%; Value: 1M; .Checked SCH: used; Supplier: Digikey; Supplier 1: Digi-Key; Supplier Part Number 1: 311-1.00MLRCT-ND; RoHS: RoHS Compliant; Stock 1: 102060; Pricing 1: 10=0.014, 50=0.0104, 100=0.0079, 250=0.00584, 500=0.00432, 1000=0.00288 (USD); Composition: Thick Film; Features: -; Size / Dimension: 0.039" L x 0.020" W (1.00mm x 0.50mm); Height: 0.016" (0.40mm); Number of Terminations: 2; Packaging: Cut Tape (CT); ComponentLink1URL: http://www.yageo.com/documents/recent/PYu-RC0402_51_RoHS_L_6.pdf; ComponentLink1Description: http://www.yageo.com/documents/recent/PYu-RC0402_51_RoHS_L_6.pdf
TP11 = TP_25MILC: Test Point 25mil; .Checked PCB: used
U18 = USB2514BI-AEZG: USB HUB CONT IND TEMP 36QFNE3; Manufacturer: Microchip Technology; Function: Hub Controller; Standards: USB 2.0; Voltage - Supply: 3 V ~ 3.6 V; Current - Supply: 85mA; .Creator: MM; .Checked PCB: used; Supplier 1: Digi-Key; Manufacturer Part Number: USB2514BI-AEZG; RoHS: RoHS Compliant; Category: Integrated Circuits (ICs); Stock 1: 1662; Pricing 1: 1=3.78, 10=3.26, 25=2.72, 100=2.47 (USD); Packaging: Tube; Protocol: USB; Interface: USB; Operating Temperature: -40°C ~ 85°C; Package / Case: 36-TQFN Exposed Pad; Supplier Device Package: 36-QFN-EP (6x6); ComponentLink1URL: http://www.smsc.com/Downloads/SMSC/Downloads_Public/Data_Sheets/251xb.pdf; ComponentLink1Description: http://www.smsc.com/Downloads/SMSC/Downloads_Public/Data_Sheets/251xb.pdf; Supplier Part Number 1: USB2514BI-AEZG-ND; .Checked SCH: used
U19 = MIC2026-1YM TR: IC SW DISTRIBUTION 2CHAN 8SOIC; Manufacturer: Micrel Inc; .Checked PCB: used; Number of Outputs: 2; Rds (On): 140 mOhm; Internal Switch(s): Yes; Current Limit: 900mA; Voltage - Input: 2.7 V ~ 5.5 V; .Checked SCH: used; Category: Integrated Circuits (ICs); Family: PMIC - Power Distribution Switches; Manufacturer Part Number: MIC2026-1YM TR; Operating Temperature: -40°C ~ 85°C; Package / Case: 8-SOIC (0.154", 3.90mm Width); Price 1k [$]: 0.53200; Supplier: Digikey; Supplier Part Number: 576-1059-1-ND; Value: MIC2026-1YM TR; Supplier 1: Digi-Key; Supplier Part Number 1: 576-1059-1-ND; RoHS: RoHS Compliant; Stock 1: 44857; Pricing 1: 1=1.14, 25=0.95, 100=0.76, 250=0.57, 500=0.532 (USD); Type: High Side Switch; Mounting Type: Surface Mount; Supplier Device Package: 8-SOIC; Packaging: Cut Tape (CT); ComponentLink1URL: http://www.micrel.com/_PDF/mic2026.pdf; ComponentLink1Description: http://www.micrel.com/_PDF/mic2026.pdf
Y4 = ABM8-24.000MHZ-R60-D-1-W-T: CRYSTAL 24MHZ 18PF SMD; Manufacturer: Abracon Corporation; Frequency Stability: ±25ppm; Frequency Tolerance: ±10ppm; ESR (Equivalent Series Resistance): 50 Ohm; Operating Mode: Fundamental; .Creator: MM; .Checked PCB: used; Supplier 1: Digi-Key; Manufacturer Part Number: ABM8-24.000MHZ-R60-D-1-W-T; RoHS: RoHS Compliant; Category: Crystals and Oscillators; Stock 1: 11496; Pricing 1: 1=1.42, 10=1.356, 50=1.326, 100=1.134, 500=1.104 (USD); Packaging: Cut Tape (CT); Type: MHz Crystal; Frequency: 24MHz; Load Capacitance: 18pF; Operating Temperature: -40°C ~ 85°C; Ratings: -; Mounting Type: Surface Mount; Package / Case: 4-SMD, No Lead (DFN, LCC); Size / Dimension: 0.126" L x 0.098" W (3.20mm x 2.50mm); Height: 0.031" (0.80mm); ComponentLink1URL: http://www.abracon.com/Resonators/abm8.pdf; ComponentLink1Description: http://www.abracon.com/Resonators/abm8.pdf; Supplier Part Number 1: 535-10155-1-ND; .Checked SCH: used

## Sheet [07] - CPU - CSI, FLASH.SchDoc
size A2; DocumentNumber: 7; SheetNumber: 7; SheetTotal: 32
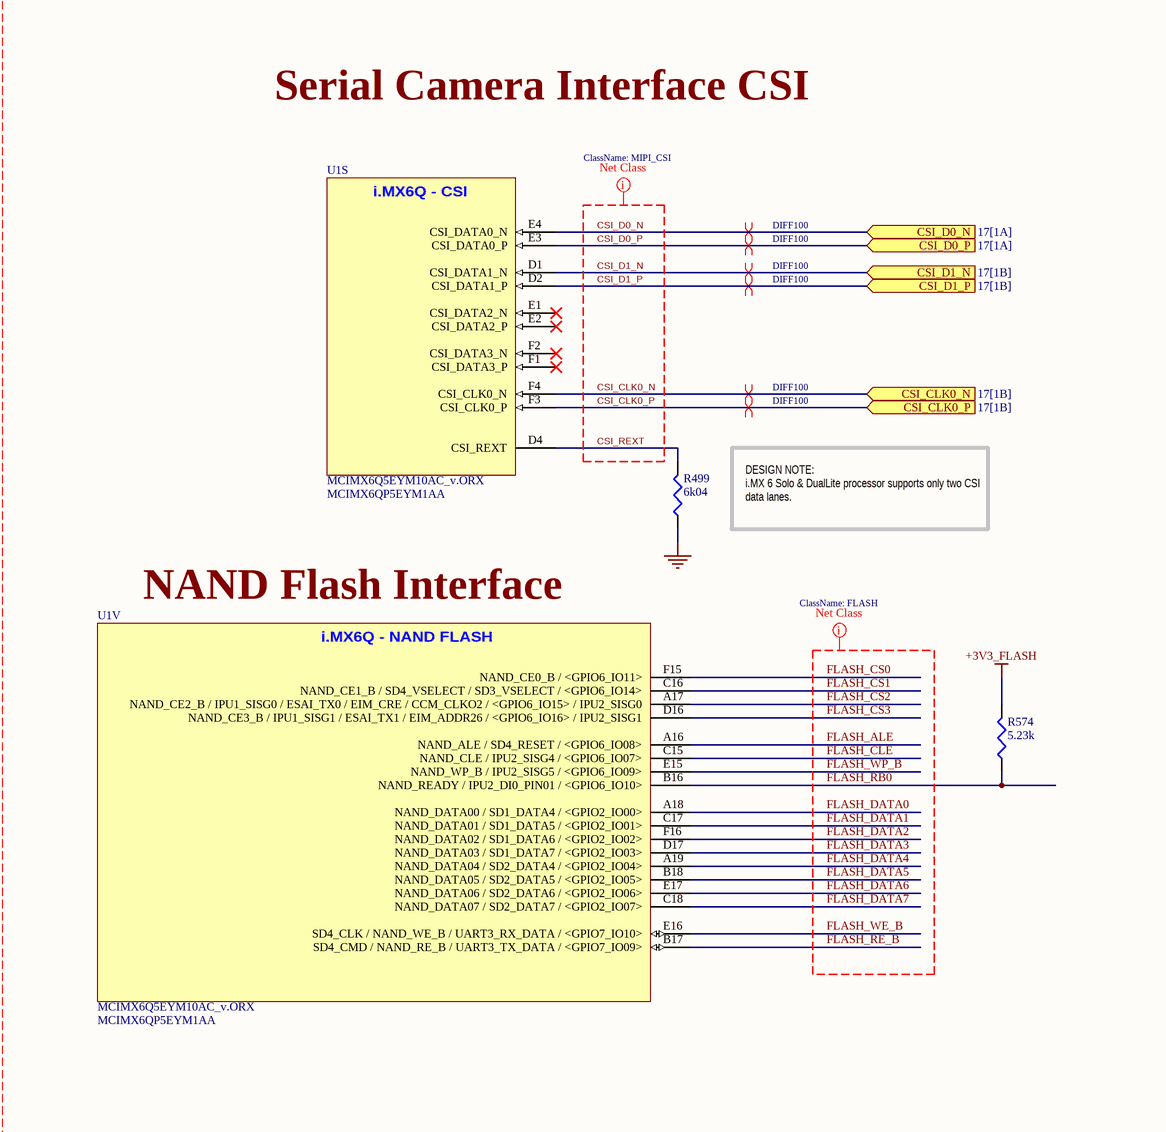
[diagram p52: [07] - CPU - CSI, FLASH.SchDoc, left]
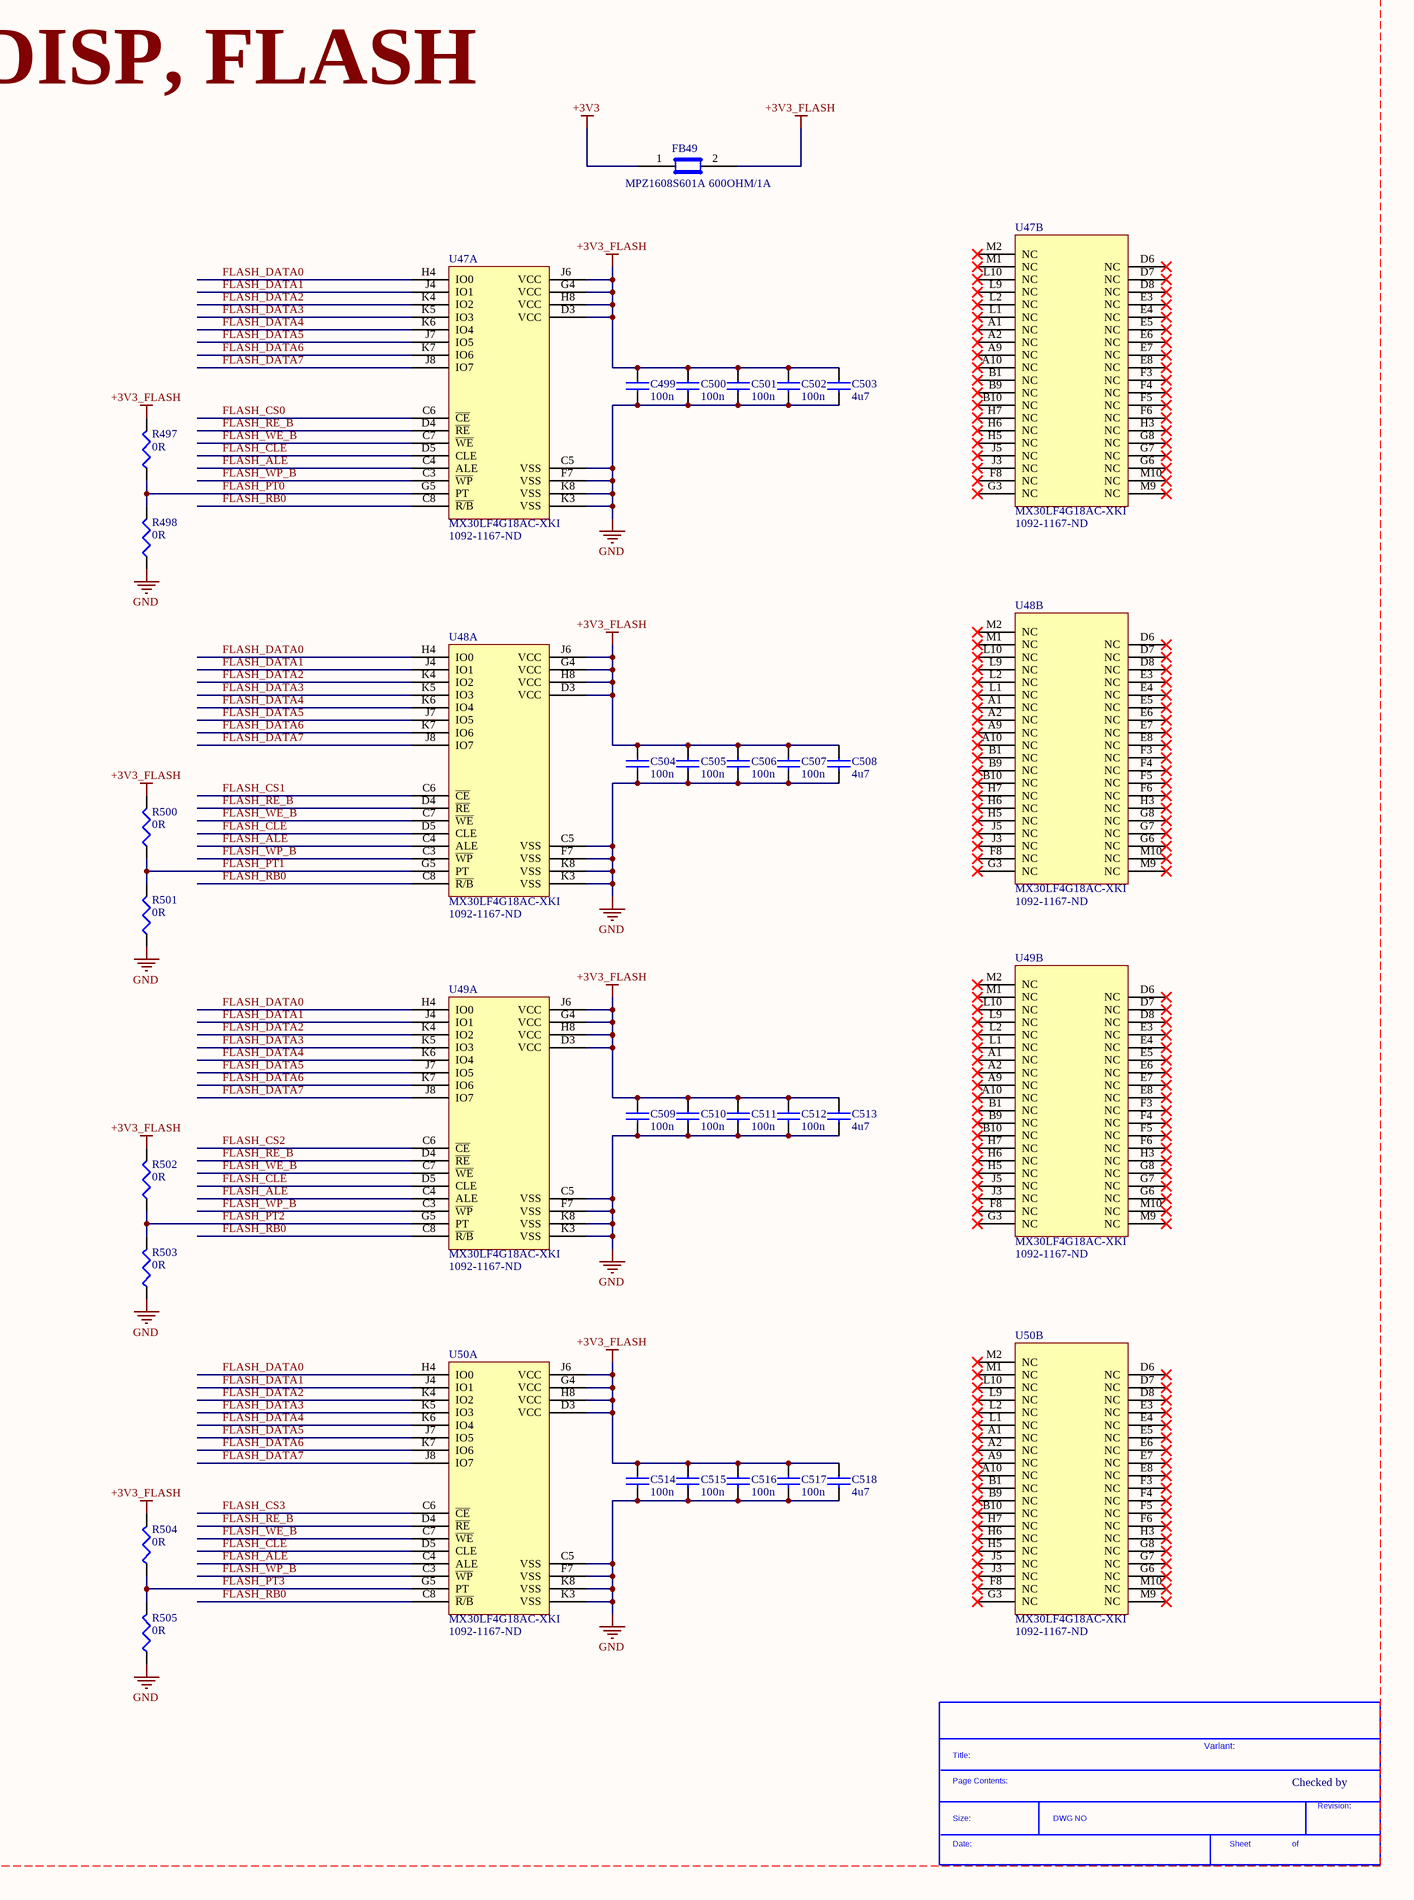
[diagram p53: [07] - CPU - CSI, FLASH.SchDoc, right]

### Parts
(Parts that share a designator on the sheet are numbered #1, #2 ... from top to bottom, then left to right.)
*#17  SDTitleBlock  (value not drawn)  (graphical)
C499  100n  [C0402]
C500  100n  [C0402]
C501  100n  [C0402]
C502  100n  [C0402]
C503  4u7  [C0402]
C504  100n  [C0402]
C505  100n  [C0402]
C506  100n  [C0402]
C507  100n  [C0402]
C508  4u7  [C0402]
C509  100n  [C0402]
C510  100n  [C0402]
C511  100n  [C0402]
C512  100n  [C0402]
C513  4u7  [C0402]
C514  100n  [C0402]
C515  100n  [C0402]
C516  100n  [C0402]
C517  100n  [C0402]
C518  4u7  [C0402]
FB49  MPZ1608S601A 600OHM/1A  [C0603]
R497  0R  [R0402]
R498  0R  [R0402]
R499  6k04  [R0201]
R500  0R  [R0402]
R501  0R  [R0402]
R502  0R  [R0402]
R503  0R  [R0402]
R504  0R  [R0402]
R505  0R  [R0402]
R574  5.23k  [R0402]
U1  MCIMX6Q5EYM10AC_v.ORX  Supplier Part Number 2: MCIMX6QP5EYM1AA  [PBGA624]  (parts S,V of 23)
U47  MX30LF4G18AC-XKI  Supplier Part Number 1: 1092-1167-ND  [BGA63_9X11MM_FLASH]  (parts A,B of 2)
U48  MX30LF4G18AC-XKI  Supplier Part Number 1: 1092-1167-ND  [BGA63_9X11MM_FLASH]  (parts A,B of 2)
U49  MX30LF4G18AC-XKI  Supplier Part Number 1: 1092-1167-ND  [BGA63_9X11MM_FLASH]  (parts A,B of 2)
U50  MX30LF4G18AC-XKI  Supplier Part Number 1: 1092-1167-ND  [BGA63_9X11MM_FLASH]  (parts A,B of 2)

### Ports
CSI_CLK0_N (in, see 17[1B]), CSI_CLK0_P (in, see 17[1B]), CSI_D0_N (in, see 17[1A]), CSI_D0_P (in, see 17[1A]), CSI_D1_N (in, see 17[1B]), CSI_D1_P (in, see 17[1B])

### Nets
+3V3: FB49.1
+3V3_FLASH: C499.1 C500.1 C501.1 C502.1 C503.1 C504.1 C505.1 C506.1 C507.1 C508.1 C509.1 C510.1 C511.1 C512.1 C513.1 C514.1 C515.1 C516.1 C517.1 C518.1 FB49.2 R497.2 R500.2 R502.2 R504.2 R574.2 U47.D3(VCC) U47.G4(VCC) U47.H8(VCC) U47.J6(VCC) U48.D3(VCC) U48.G4(VCC) U48.H8(VCC) U48.J6(VCC) U49.D3(VCC) U49.G4(VCC) U49.H8(VCC) U49.J6(VCC) U50.D3(VCC) U50.G4(VCC) U50.H8(VCC) U50.J6(VCC)
GND: C499.2 C500.2 C501.2 C502.2 C503.2 C504.2 C505.2 C506.2 C507.2 C508.2 C509.2 C510.2 C511.2 C512.2 C513.2 C514.2 C515.2 C516.2 C517.2 C518.2 R498.1 R499.1 R501.1 R503.1 R505.1 U47.C5(VSS) U47.F7(VSS) U47.K3(VSS) U47.K8(VSS) U48.C5(VSS) U48.F7(VSS) U48.K3(VSS) U48.K8(VSS) U49.C5(VSS) U49.F7(VSS) U49.K3(VSS) U49.K8(VSS) U50.C5(VSS) U50.F7(VSS) U50.K3(VSS) U50.K8(VSS)
CSI_CLK0_N: U1.F4(CSI_CLK0_N) ; port CSI_CLK0_N
CSI_CLK0_P: U1.F3(CSI_CLK0_P) ; port CSI_CLK0_P
CSI_D0_N: U1.E4(CSI_DATA0_N) ; port CSI_D0_N
CSI_D0_P: U1.E3(CSI_DATA0_P) ; port CSI_D0_P
CSI_D1_N: U1.D1(CSI_DATA1_N) ; port CSI_D1_N
CSI_D1_P: U1.D2(CSI_DATA1_P) ; port CSI_D1_P
CSI_REXT: R499.2 U1.D4(CSI_REXT)
FLASH_ALE: U1.A16(NAND_ALE_/_SD4_RESET_/_<GPIO6_IO08>) U47.C4(ALE) U48.C4(ALE) U49.C4(ALE) U50.C4(ALE)
FLASH_CLE: U1.C15(NAND_CLE_/_IPU2_SISG4_/_<GPIO6_IO07>) U47.D5(CLE) U48.D5(CLE) U49.D5(CLE) U50.D5(CLE)
FLASH_CS0: U1.F15(NAND_CE0_B_/_<GPIO6_IO11>) U47.C6(~{CE})
FLASH_CS1: U1.C16(NAND_CE1_B_/_SD4_VSELECT_/_SD3_VSELECT_/_<GPIO6_IO14>) U48.C6(~{CE})
FLASH_CS2: U1.A17(NAND_CE2_B_/_IPU1_SISG0_/_ESAI_TX0_/_EIM_CRE_/_CCM_CLKO2_/_<GPIO6_IO15>_/_IPU2_SISG0) U49.C6(~{CE})
FLASH_CS3: U1.D16(NAND_CE3_B_/_IPU1_SISG1_/_ESAI_TX1_/_EIM_ADDR26_/_<GPIO6_IO16>_/_IPU2_SISG1) U50.C6(~{CE})
FLASH_DATA0: U1.A18(NAND_DATA00_/_SD1_DATA4_/_<GPIO2_IO00>) U47.H4(IO0) U48.H4(IO0) U49.H4(IO0) U50.H4(IO0)
FLASH_DATA1: U1.C17(NAND_DATA01_/_SD1_DATA5_/_<GPIO2_IO01>) U47.J4(IO1) U48.J4(IO1) U49.J4(IO1) U50.J4(IO1)
FLASH_DATA2: U1.F16(NAND_DATA02_/_SD1_DATA6_/_<GPIO2_IO02>) U47.K4(IO2) U48.K4(IO2) U49.K4(IO2) U50.K4(IO2)
FLASH_DATA3: U1.D17(NAND_DATA03_/_SD1_DATA7_/_<GPIO2_IO03>) U47.K5(IO3) U48.K5(IO3) U49.K5(IO3) U50.K5(IO3)
FLASH_DATA4: U1.A19(NAND_DATA04_/_SD2_DATA4_/_<GPIO2_IO04>) U47.K6(IO4) U48.K6(IO4) U49.K6(IO4) U50.K6(IO4)
FLASH_DATA5: U1.B18(NAND_DATA05_/_SD2_DATA5_/_<GPIO2_IO05>) U47.J7(IO5) U48.J7(IO5) U49.J7(IO5) U50.J7(IO5)
FLASH_DATA6: U1.E17(NAND_DATA06_/_SD2_DATA6_/_<GPIO2_IO06>) U47.K7(IO6) U48.K7(IO6) U49.K7(IO6) U50.K7(IO6)
FLASH_DATA7: U1.C18(NAND_DATA07_/_SD2_DATA7_/_<GPIO2_IO07>) U47.J8(IO7) U48.J8(IO7) U49.J8(IO7) U50.J8(IO7)
FLASH_PT0: R497.1 R498.2 U47.G5(PT)
FLASH_PT1: R500.1 R501.2 U48.G5(PT)
FLASH_PT2: R502.1 R503.2 U49.G5(PT)
FLASH_PT3: R504.1 R505.2 U50.G5(PT)
FLASH_RB0: R574.1 U1.B16(NAND_READY_/_IPU2_DI0_PIN01_/_<GPIO6_IO10>) U47.C8(~{R/B}) U48.C8(~{R/B}) U49.C8(~{R/B}) U50.C8(~{R/B})
FLASH_RE_B: U1.B17(SD4_CMD_/_NAND_RE_B_/_UART3_TX_DATA_/_<GPIO7_IO09>) U47.D4(~{RE}) U48.D4(~{RE}) U49.D4(~{RE}) U50.D4(~{RE})
FLASH_WE_B: U1.E16(SD4_CLK_/_NAND_WE_B_/_UART3_RX_DATA_/_<GPIO7_IO10>) U47.C7(~{WE}) U48.C7(~{WE}) U49.C7(~{WE}) U50.C7(~{WE})
FLASH_WP_B: U1.E15(NAND_WP_B_/_IPU2_SISG5_/_<GPIO6_IO09>) U47.C3(~{WP}) U48.C3(~{WP}) U49.C3(~{WP}) U50.C3(~{WP})

Not connected (* = marked no-connect by the designer): U1 E1(CSI_DATA2_N)* E2(CSI_DATA2_P)* F1(CSI_DATA3_P)* F2(CSI_DATA3_N)*; U47 A1(NC)* A2(NC)* A9(NC)* A10(NC)* B1(NC)* B9(NC)* B10(NC)* D6(NC)* D7(NC)* D8(NC)* E3(NC)* E4(NC)* E5(NC)* E6(NC)* E7(NC)* E8(NC)* F3(NC)* F4(NC)* F5(NC)* F6(NC)* F8(NC)* G3(NC)* G6(NC)* G7(NC)* G8(NC)* H3(NC)* H5(NC)* H6(NC)* H7(NC)* J3(NC)* J5(NC)* L1(NC)* L2(NC)* L9(NC)* L10(NC)* M1(NC)* M2(NC)* M9(NC)* M10(NC)*; U48 A1(NC)* A2(NC)* A9(NC)* A10(NC)* B1(NC)* B9(NC)* B10(NC)* D6(NC)* D7(NC)* D8(NC)* E3(NC)* E4(NC)* E5(NC)* E6(NC)* E7(NC)* E8(NC)* F3(NC)* F4(NC)* F5(NC)* F6(NC)* F8(NC)* G3(NC)* G6(NC)* G7(NC)* G8(NC)* H3(NC)* H5(NC)* H6(NC)* H7(NC)* J3(NC)* J5(NC)* L1(NC)* L2(NC)* L9(NC)* L10(NC)* M1(NC)* M2(NC)* M9(NC)* M10(NC)*; U49 A1(NC)* A2(NC)* A9(NC)* A10(NC)* B1(NC)* B9(NC)* B10(NC)* D6(NC)* D7(NC)* D8(NC)* E3(NC)* E4(NC)* E5(NC)* E6(NC)* E7(NC)* E8(NC)* F3(NC)* F4(NC)* F5(NC)* F6(NC)* F8(NC)* G3(NC)* G6(NC)* G7(NC)* G8(NC)* H3(NC)* H5(NC)* H6(NC)* H7(NC)* J3(NC)* J5(NC)* L1(NC)* L2(NC)* L9(NC)* L10(NC)* M1(NC)* M2(NC)* M9(NC)* M10(NC)*; U50 A1(NC)* A2(NC)* A9(NC)* A10(NC)* B1(NC)* B9(NC)* B10(NC)* D6(NC)* D7(NC)* D8(NC)* E3(NC)* E4(NC)* E5(NC)* E6(NC)* E7(NC)* E8(NC)* F3(NC)* F4(NC)* F5(NC)* F6(NC)* F8(NC)* G3(NC)* G6(NC)* G7(NC)* G8(NC)* H3(NC)* H5(NC)* H6(NC)* H7(NC)* J3(NC)* J5(NC)* L1(NC)* L2(NC)* L9(NC)* L10(NC)* M1(NC)* M2(NC)* M9(NC)* M10(NC)*

### Layout directives
differential pair; net class DIFF100: CSI_CLK0_N, CSI_CLK0_P, CSI_D0_N, CSI_D0_P, CSI_D1_N, CSI_D1_P
net class MIPI_CSI: CSI_CLK0_N, CSI_CLK0_P, CSI_D0_N, CSI_D0_P, CSI_D1_N, CSI_D1_P, CSI_REXT
net class [07] - CPU - CSI/FLASH: +3V3, +3V3_FLASH, CSI_CLK0_N, CSI_CLK0_P, CSI_D0_N, CSI_D0_P, CSI_D1_N, CSI_D1_P, CSI_REXT, FLASH_ALE, FLASH_CLE, FLASH_CS0, FLASH_CS1, FLASH_CS2, FLASH_CS3, FLASH_DATA0, FLASH_DATA1, FLASH_DATA2, FLASH_DATA3, FLASH_DATA4, FLASH_DATA5, FLASH_DATA6, FLASH_DATA7, FLASH_PT0, FLASH_PT1, FLASH_PT2, FLASH_PT3, FLASH_RB0, FLASH_RE_B, FLASH_WE_B, FLASH_WP_B, GND
net class FLASH: FLASH_ALE, FLASH_CLE, FLASH_CS0, FLASH_CS1, FLASH_CS2, FLASH_CS3, FLASH_DATA0, FLASH_DATA1, FLASH_DATA2, FLASH_DATA3, FLASH_DATA4, FLASH_DATA5, FLASH_DATA6, FLASH_DATA7, FLASH_RB0, FLASH_RE_B, FLASH_WE_B, FLASH_WP_B

### Notes on the sheet
- CPU - CSI, DISP, FLASH
- Serial Camera Interface CSI
- DESIGN NOTE:
  i.MX 6 Solo & DualLite processor supports only two CSI data lanes.
- NAND Flash Interface
- Variant:
- Checked by
- (in symbol MCIMX6Q5EYM10AC_v.ORX, part S) i.MX6Q - CSI
- (in symbol MCIMX6Q5EYM10AC_v.ORX, part V) i.MX6Q - NAND FLASH
- (in symbol SDTitleBlock) Title:; Page Contents:; Revision:; Size:; DWG NO; Date:; Sheet; of

### Library data of the parts
C499-C502 C504-C507 C509-C512 C514-C517 = C1005X5R1H104K: as C241 on sheet [19] - USB; Category: Capacitors; Supplier Part Number: 445-5942-1-ND; Manufacturer Part Number: C1005X5R1H104K; Operating Temperature: -55°C ~ 85°C; Package / Case: 0402 (1005 Metric); Price 1k [$]: 0.02340; .Checked SCH: used; Voltage - Rated: 50V; Supplier: Digikey; Supplier 1: Digi-Key; Supplier Part Number 1: 445-5942-1-ND; RoHS: RoHS Compliant; Stock 1: 106926; Pricing 1: 1=0.27, 10=0.18, 100=0.072, 250=0.05176, 500=0.0369, 1000=0.027 (USD); Tolerance: ±10%; Temperature Coefficient: X5R; Mounting Type: Surface Mount, MLCC; Applications: General Purpose; Ratings: -; Size / Dimension: 0.039" L x 0.020" W (1.00mm x 0.50mm); Height - Seated (Max): -; Thickness (Max): 0.022" (0.55mm); Lead Spacing: -; Features: -; Packaging: Cut Tape (CT); Lead Style: -; ComponentLink1URL: http://www.tdk.co.jp/tefe02/e412_c.pdf; ComponentLink1Description: http://www.tdk.co.jp/tefe02/e412_c.pdf; Supplier 2: Digi-Key; Supplier Part Number 2: 311-1697-6-ND
C503 C508 C513 C518 = C1005X5R1A475M: as C251 on sheet [19] - USB; Supplier 1: Digi-Key; Supplier Part Number 1: 445-8023-1-ND; Manufacturer Part Number: C1005X5R1A475M; RoHS: RoHS Compliant; Category: Capacitors; Stock 1: 10140; Pricing 1: 1=0.53, 10=0.415, 100=0.25, 250=0.18752, 500=0.16, 1000=0.125, 5000=0.095 (USD); Voltage - Rated: 10V; Tolerance: ±20%; Temperature Coefficient: X5R; Mounting Type: Surface Mount, MLCC; Operating Temperature: -55°C ~ 85°C; Applications: General Purpose; Ratings: -; Package / Case: 0402 (1005 Metric); Size / Dimension: 0.039" L x 0.020" W (1.00mm x 0.50mm); Height - Seated (Max): -; Thickness (Max): -; Lead Spacing: -; Features: -; Packaging: Cut Tape (CT); Lead Style: -; ComponentLink1URL: http://www.tdk.com/pdf/general_B11.pdf; ComponentLink1Description: http://www.tdk.com/pdf/general_B11.pdf; .Checked SCH: used
FB49 = MPZ1608S601A: as FB12 on sheet [19] - USB; Supplier 1: Digi-Key; Supplier Part Number 1: 445-2205-1-ND; Manufacturer Part Number: MPZ1608S601A; RoHS: RoHS Compliant; Category: Filters; Stock 1: 328345; Pricing 1: 1=0.36, 10=0.24, 100=0.096, 250=0.069, 500=0.0492, 1000=0.036 (USD); Current Rating: 1A; Package / Case: 0603 (1608 Metric); Mounting Type: Surface Mount; Packaging: Cut Tape (CT); Height (Max): 0.037" (0.95mm); Size / Dimension: 0.063" L x 0.031" W (1.60mm x 0.80mm); ComponentLink1URL: http://www.tdk.co.jp/tefe02/e9413_mpz.pdf; ComponentLink1Description: http://www.tdk.co.jp/tefe02/e9413_mpz.pdf; .Checked SCH: used
R497 R498 R500-R505 = RC0402JR-070RL: as R157-R160 on sheet [19] - USB; Category: Resistors; Supplier Part Number: 311-0.0JRCT-ND; Manufacturer Part Number: RC0402JR-070RL; Package / Case: 0402 (1005 Metric); Price 1k [$]: 0.01389; Value: 0R; .Checked SCH: used; Supplier: Digikey; Supplier 1: Digi-Key; Supplier Part Number 1: 311-0.0JRCT-ND; RoHS: RoHS Compliant; Stock 1: 1106330; Pricing 1: 10=0.012, 50=0.009, 100=0.0069, 250=0.00512, 500=0.0038, 1000=0.00253 (USD); Composition: Thick Film; Features: -; Temperature Coefficient: -; Size / Dimension: 0.039" L x 0.020" W (1.00mm x 0.50mm); Height: 0.016" (0.40mm); Number of Terminations: 2; Packaging: Cut Tape (CT); ComponentLink1URL: http://www.yageo.com/documents/recent/PYu-RC0402_51_RoHS_L_6.pdf; ComponentLink1Description: http://www.yageo.com/documents/recent/PYu-RC0402_51_RoHS_L_6.pdf
R499 = ERJ-1GEF6041C: RES 6.04K OHM 1/20W 1% 0201 SMD; Manufacturer: Panasonic Electronic Components; Power (Watts): 0.05W, 1/20W; Temperature Coefficient: ±200ppm/°C; .Creator: MM; .Checked PCB: used; Supplier 1: Digi-Key; Manufacturer Part Number: ERJ-1GEF6041C; RoHS: RoHS Compliant; Category: Resistors; Stock 1: 78155; Pricing 1: 1=0.11, 50=0.0414, 100=0.0315, 250=0.0234, 500=0.01728, 1000=0.01152, 5000=0.0081 (USD); Packaging: Cut Tape (CT); Resistance (Ohms): 6.04k; Tolerance: ±1%; Composition: Thick Film; Features: -; Package / Case: 0201 (0603 Metric); Supplier Device Package: 0201; Size / Dimension: 0.024" L x 0.012" W (0.60mm x 0.30mm); Height: 0.010" (0.26mm); Number of Terminations: 2; ComponentLink1URL: http://media.digikey.com/pdf/Data%20Sheets/Panasonic%20Resistors%20Thermistors%20PDFs/ERJ_G,R,E_Rev08.pdf; ComponentLink1Description: http://media.digikey.com/pdf/Data%20Sheets/Panasonic%20Resistors%20Thermistors%20PDFs/ERJ_G,R,E_Rev08.pdf; Supplier Part Number 1: P6.04KABCT-ND; .Checked SCH: used
R574 = CRCW04025K23FKED: RES SMD 5.23K OHM 1% 1/16W 0402; Manufacturer: Vishay Dale; Power (Watts): 0.063W, 1/16W; Temperature Coefficient: ±100ppm/°C; .Creator: MB; Supplier 1: Digi-Key; Manufacturer Part Number: CRCW04025K23FKED; RoHS: RoHS Compliant; Category: Resistors; Stock 1: 224047; Pricing 1: 1=0.1, 10=0.044, 100=0.0178, 1000=0.00802, 2500=0.00696, 5000=0.00575 (USD); Packaging: Cut Tape (CT); Part Status: Active; Tolerance: ±1%; Composition: Thick Film; Features: Automotive AEC-Q200; Operating Temperature: -55°C ~ 155°C; Package / Case: 0402 (1005 Metric); Supplier Device Package: 0402; Size / Dimension: 0.039" L x 0.020" W (1.00mm x 0.50mm); Height - Seated (Max): 0.016" (0.40mm); Failure Rate: -; ComponentLink1URL: http://www.vishay.com/docs/20035/dcrcwe3.pdf; ComponentLink1Description: http://www.vishay.com/docs/20035/dcrcwe3.pdf; Supplier Part Number 1: 541-5.23KLCT-ND; .Checked PCB: *; .Checked SCH: *; Supplier 2: Digi-Key; Stock 2: 246159; Pricing 2: 1=0.1, 10=0.044, 100=0.0178, 1000=0.00802, 2500=0.00696, 5000=0.00575 (USD); Supplier Part Number 2: 541-30.1KLCT-ND
U1 = MCIMX6Q5EYM10AC_v.ORX: IC MCU 32BIT ARM QUAD 624FCBGA; Manufacturer: Freescale Semiconductor; Core Processor: ARM® Cortex™-A9; Core Size: 32-Bit Quad-Core; Speed: 1.0GHz; Connectivity: CAN, EBI/EMI, ESAI, Ethernet, GPMI, I2C, MMC/SD, PCI, SATA, SPI, UART, USB, USB OTG; Peripherals: DMA, HDMI, I2S/SSI/AC97, MIPI CSI, MIMI DSI, MIPI HIS, PWM, WDT; Number of I /O: 224; Program Memory Type: External Program Memory; RAM Size: 256K x 8; Voltage - Supply (Vcc/Vdd): 0.925 V ~ 1.5 V; Oscillator Type: Internal; .Creator: MM; .Checked PCB: used; Supplier 1: Digi-Key; Manufacturer Part Number: MCIMX6Q5EYM10AC; RoHS: RoHS Compliant; Category: Integrated Circuits (ICs); Stock 1: 0; Pricing 1: 1=54.98, 10=51.922, 25=48.868, 100=30.5424 (USD); Program Memory Size: -; EEPROM Size: -; Data Converters: -; Operating Temperature: -20°C ~ 105°C; Package / Case: 624-FBGA, FCBGA; Packaging: Tray; ComponentLink1URL: http://cache.freescale.com/files/32bit/doc/data_sheet/IMX6DQCEC.pdf; ComponentLink1Description: Data Sheet; Supplier Part Number 1: MCIMX6Q5EYM10AC-ND; .Checked SCH: used; ComponentLink2Description: User Guide; ComponentLink2URL: file:///C:/Users/mbeach/Downloads/i.MX_Linux_User's_Guide.pdf; Supplier 2: Arrow
U47-U50 = MX30LF4G18AC-XKI: IC FLASH MEM 4GBIT NAND 63VFBGA; Manufacturer: Macronix; Memory Type: NAND,FLASH; Interface: Parallel; Supplier 1: Digi-Key; Manufacturer Part Number: MX30LF4G18AC-XKI; Number of Pins: 63; Min Operating Temperature: -40°C; Max Operating Temperature: 85°C; Packaging: Tray; ComponentLink1URL: http://www.macronix.com/Lists/Datasheet/Attachments/6517/MX30LF2G18AC,%203V,%202Gb,%20v1.4.pdf; ComponentLink1Description: Data Sheet